# Altium project NearField_PCB_Probes.PrjPcb
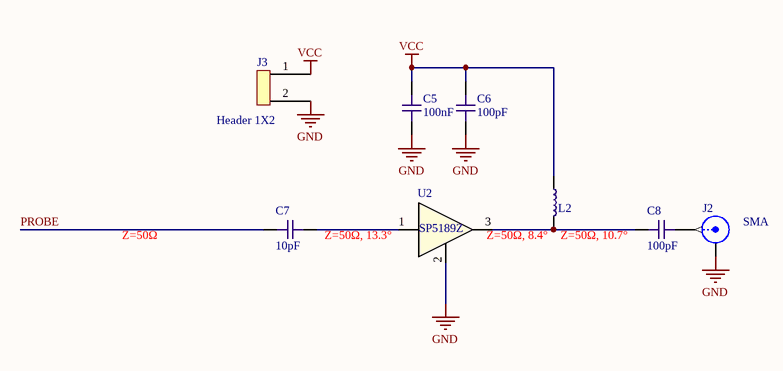
[diagram p0: NearField_E_Probe.SchDoc]
2 sheets, 16 parts. Net scope: global (net labels, ports and power ports of the same name join across sheets).
Board file: NearField_PCB_Probes.PcbDoc
Sheets:
  NearField_E_Probe.SchDoc
  NearField_H_Probe.SchDoc

## Sheet NearField_E_Probe.SchDoc
size A4

### Parts
C5  value 100nF  [C0402-IPC]  (hidden comment: C0402 100nF 10V X5R)
C6  value 100pF  [C0402-IPC]  (hidden comment: C0402 100pF 50V C0G)
C7  value 10pF  [C0402-IPC]  (hidden comment: C0402 10pF 50V C0G)
C8  value 100pF  [C0402-IPC]  (hidden comment: C0402 100pF 50V C0G)
J2  SMA  [SMA Edge Launch (Horizontal)]
J3  Header 1X2  [Header 1x2 TH Pitch 2.54mm]
L2  LQW15AN47NG8ZD  [L0402-Murata-WW-High-Density]  (value not drawn)
U2  SP5189Z  [SOT-89]

### Nets
GND: C5.1 C6.1 J2.2(Y) J3.2 U2.2(GND)
VCC: C5.2 C6.2 J3.1 L2.1
PROBE: C7.1
NetC7_2: C7.2 U2.1(RFIN)
NetC8_1: C8.1 L2.2 U2.3(RFOUT/DCBIAS)
NetC8_2: C8.2 J2.1(X)

### Notes on the sheet
- Z=50Ω
- Z=50Ω, 13.3°
- Z=50Ω, 8.4°
- Z=50Ω, 10.7°

### Library data of the parts
C5 = C0402 100nF 10V X5R: Chip Capacitor, 0402, 100nF, 10V, X5R; EIA Code: X5R; Max. Voltage: 10V; Supplier 1: Digi-Key; Supplier Part Number 1: 311-1336-1-ND
C6 C8 = C0402 100pF 50V C0G: Chip Capacitor, 0402, 100p, 1%, 50V, C0G; Max. Voltage: 50V; EIA Code: C0G; Supplier 1: Digi-Key; Supplier Part Number 1: 490-7753-1-ND
C7 = C0402 10pF 50V C0G: Chip Capacitor, 0402, 10pF, 50V, C0G; Max. Voltage: 50V; EIA Code: C0G; Supplier 1: Digi-Key; Supplier Part Number 1: 490-8077-1-ND
J2 = SMA: SMA Connector; Supplier 1: Digi-Key; Supplier Part Number 1: A97594-ND
L2 = L0402 47nH High-Q: 47nH Unshielded Wirewound Inductor 440mA 648mOhm Max 0402 (1005 Metric); Supplier 1: Digi-Key; Supplier 2: Mouser; Supplier Part Number 1: 490-15449-1-ND; Supplier Part Number 2: 81-LQW15AN47NG8ZD; Value: 47nH
U2 = SPF5189Z: RF Amplifier .05-4GHz SSG 12.8dB NF .8dB GaAs; Supplier 2: Mouser; Supplier Part Number 2: 772-SPF5189Z

## Sheet NearField_H_Probe.SchDoc
size A4
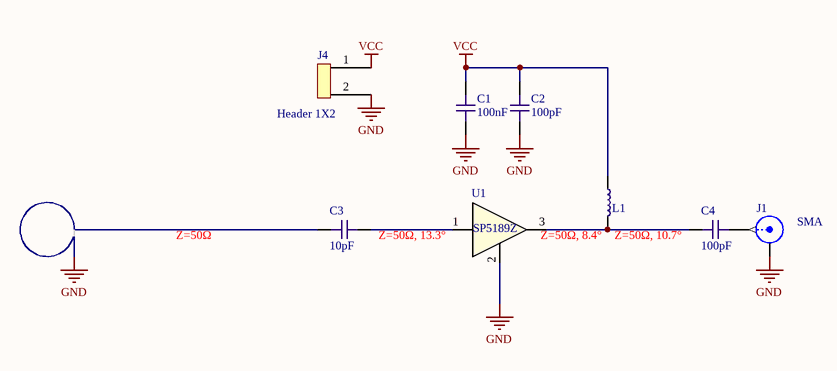
[diagram p1: NearField_H_Probe.SchDoc]

### Parts
C1  value 100nF  [C0402-IPC]  (hidden comment: C0402 100nF 10V X5R)
C2  value 100pF  [C0402-IPC]  (hidden comment: C0402 100pF 50V C0G)
C3  value 10pF  [C0402-IPC]  (hidden comment: C0402 10pF 50V C0G)
C4  value 100pF  [C0402-IPC]  (hidden comment: C0402 100pF 50V C0G)
J1  SMA  [SMA Edge Launch (Horizontal)]
J4  Header 1X2  [Header 1x2 TH Pitch 2.54mm]
L1  LQW15AN47NG8ZD  [L0402-Murata-WW-High-Density]  (value not drawn)
U1  SP5189Z  [SOT-89]

### Nets
GND: C1.1 C2.1 C3.1 J1.2(Y) J4.2 U1.2(GND)
VCC: C1.2 C2.2 J4.1 L1.1
NetC3_2: C3.2 U1.1(RFIN)
NetC4_1: C4.1 L1.2 U1.3(RFOUT/DCBIAS)
NetC4_2: C4.2 J1.1(X)

### Notes on the sheet
- Z=50Ω
- Z=50Ω, 13.3°
- Z=50Ω, 8.4°
- Z=50Ω, 10.7°

### Library data of the parts
C1 = C0402 100nF 10V X5R: Chip Capacitor, 0402, 100nF, 10V, X5R; EIA Code: X5R; Max. Voltage: 10V; Supplier 1: Digi-Key; Supplier Part Number 1: 311-1336-1-ND
C2 C4 = C0402 100pF 50V C0G: Chip Capacitor, 0402, 100p, 1%, 50V, C0G; Max. Voltage: 50V; EIA Code: C0G; Supplier 1: Digi-Key; Supplier Part Number 1: 490-7753-1-ND
C3 = C0402 10pF 50V C0G: Chip Capacitor, 0402, 10pF, 50V, C0G; Max. Voltage: 50V; EIA Code: C0G; Supplier 1: Digi-Key; Supplier Part Number 1: 490-8077-1-ND
J1 = SMA: SMA Connector; Supplier 1: Digi-Key; Supplier Part Number 1: A97594-ND
L1 = L0402 47nH High-Q: as L2 on sheet NearField_E_Probe; Supplier 1: Digi-Key; Supplier 2: Mouser; Supplier Part Number 1: 490-15449-1-ND; Supplier Part Number 2: 81-LQW15AN47NG8ZD; Value: 47nH
U1 = SPF5189Z: as U2 on sheet NearField_E_Probe; Supplier 2: Mouser; Supplier Part Number 2: 772-SPF5189Z

## Nets that join several sheets
GND: NearField_E_Probe (5 pins), NearField_H_Probe (6 pins)
VCC: NearField_E_Probe (C5.2 C6.2 J3.1 L2.1), NearField_H_Probe (C1.2 C2.2 J4.1 L1.1)